# Altium schematic sheet IDC2BNC.SchDoc: IDC to BNC
size 420 x 297 mm; Author: G.K.; CompanyName: WUT; DrawnBy: G.K.; Organization: WUT ISE; Address1: Warsaw Univeristy of Technology; Address2: Nowowiejska 15/19; DocumentNumber: 3; Revision: -; SheetNumber: 3; SheetTotal: 7; EDA_Number: ARTIQ; Projet: ARTIQ/SINARA; ModifiedBy: -; CreateDate: XX/XX/XXXX; CheckedDate: -; Title2: adapter; DivGrp: ISE; Designer: G.K.; ModifiedDate: -; ProjectName: 32 CHANNEL 16bit DAC
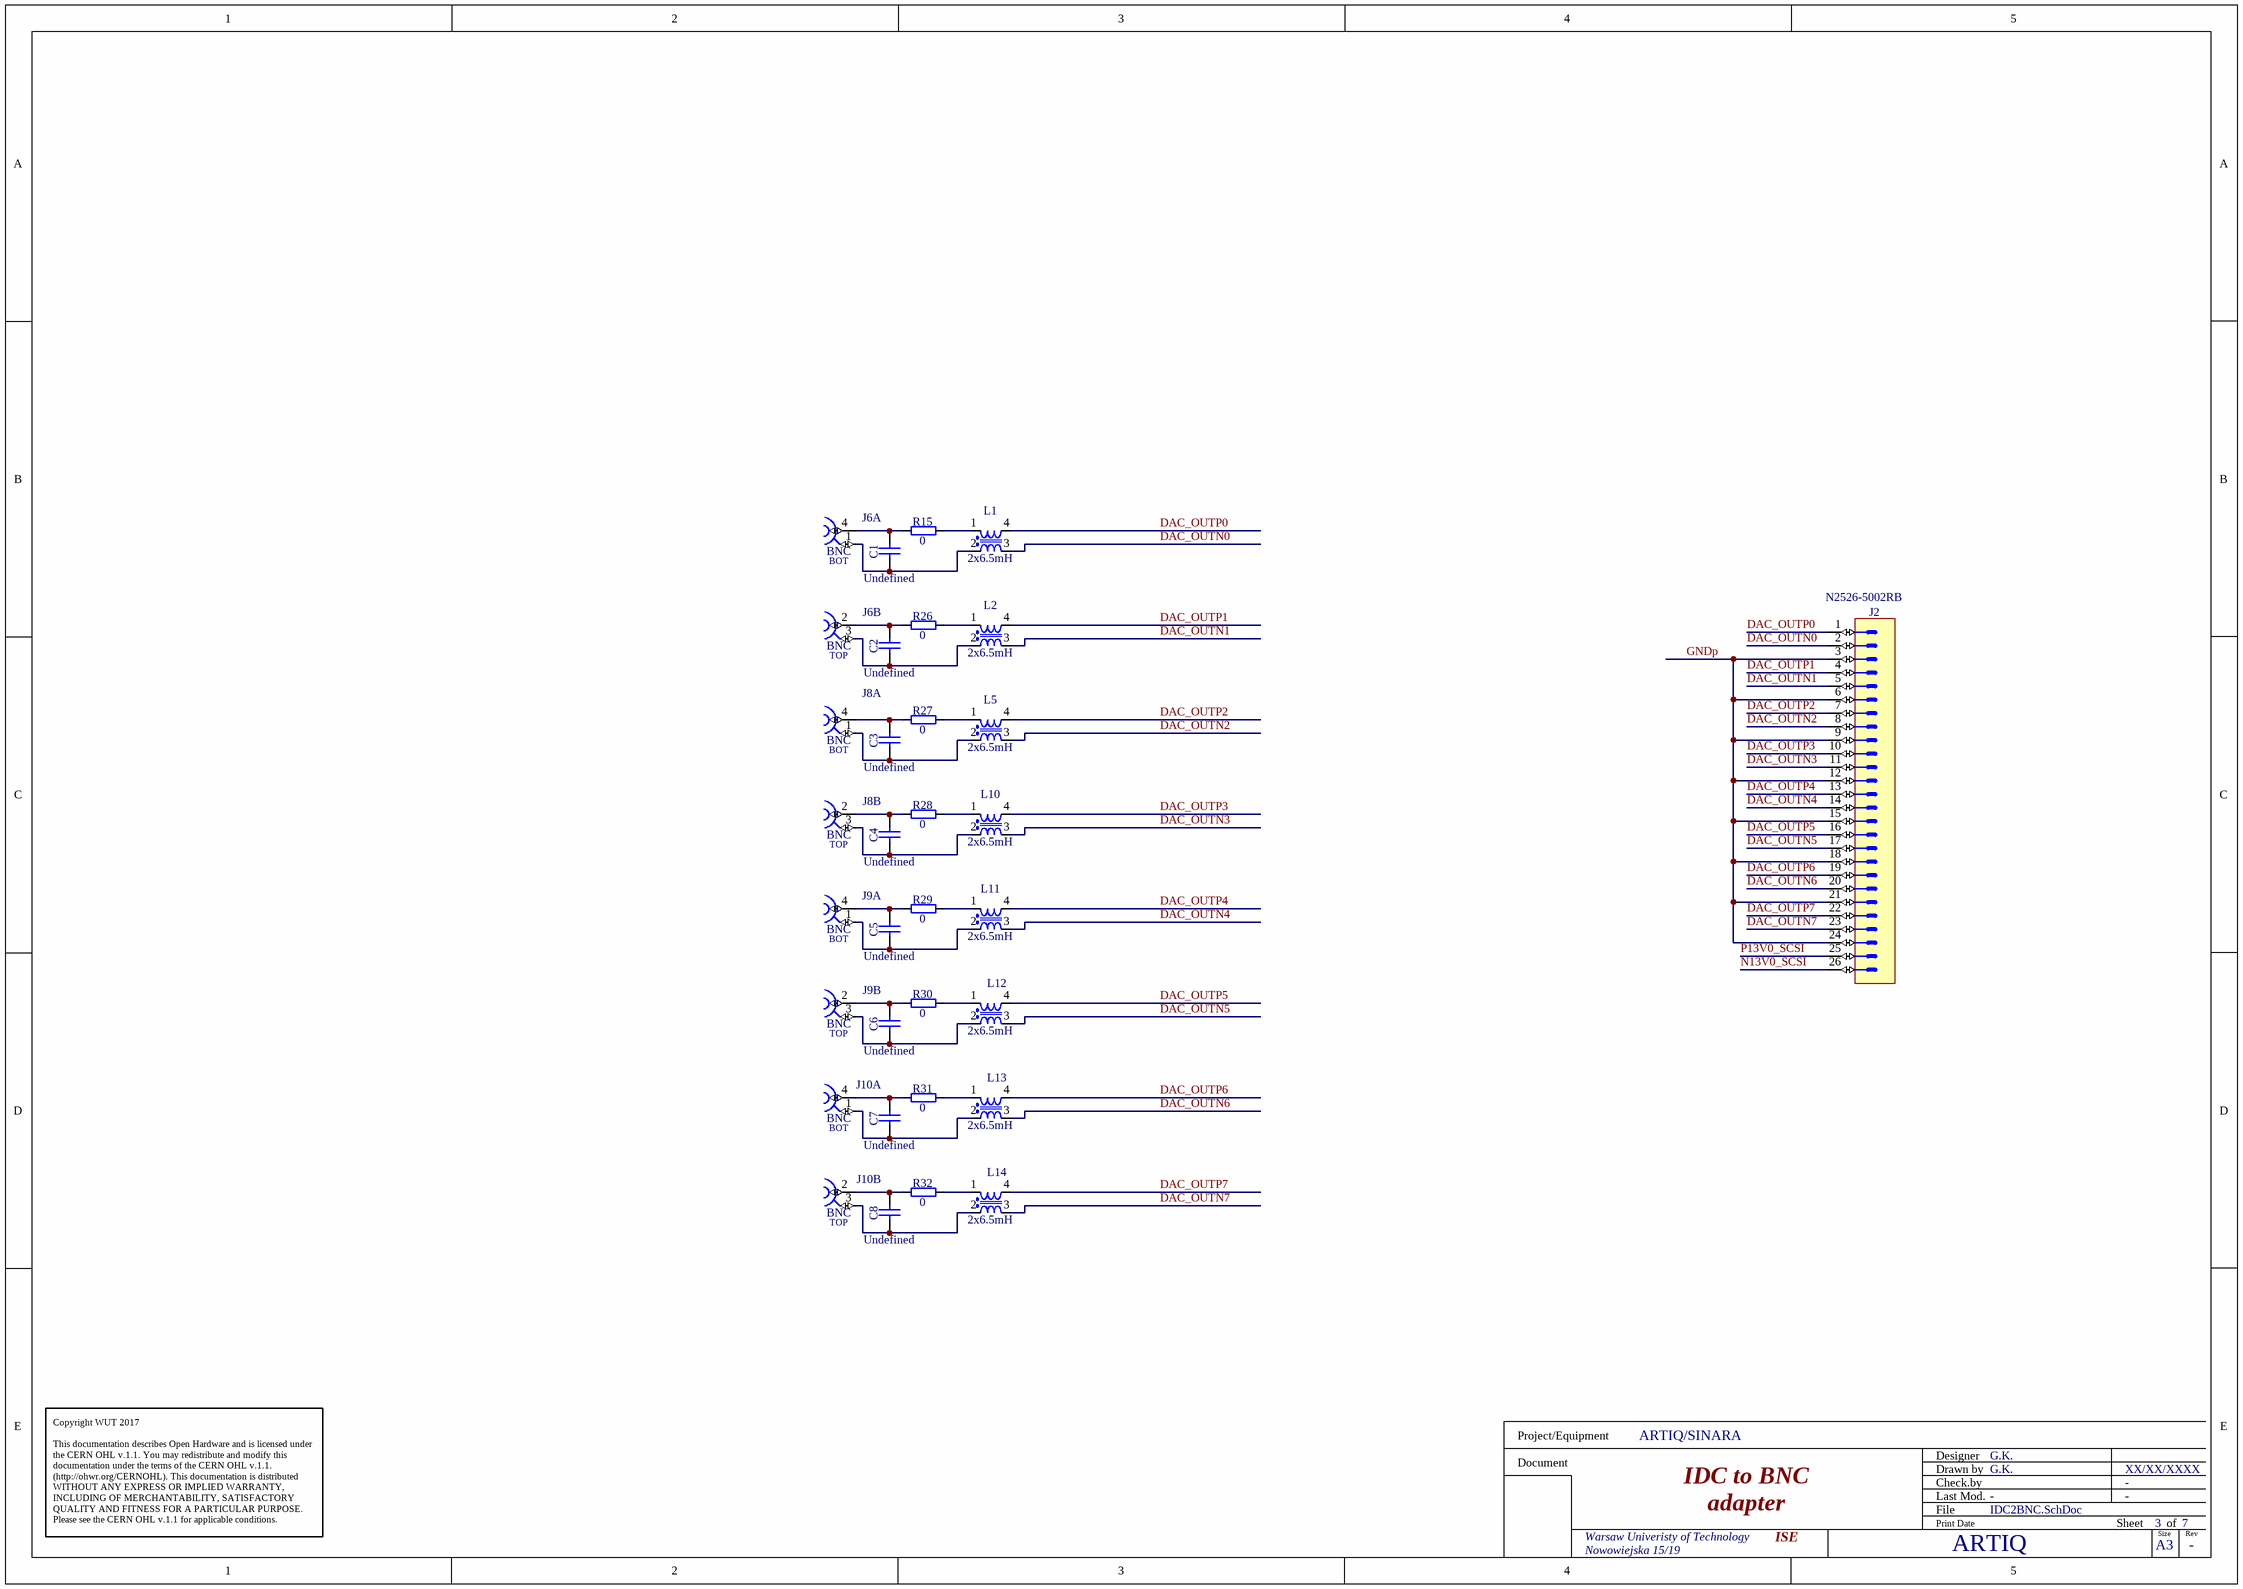
[diagram p0: IDC2BNC.SchDoc]

## Parts
C1  Undefined  [CAPC2012X135N]
C2  Undefined  [CAPC2012X135N]
C3  Undefined  [CAPC2012X135N]
C4  Undefined  [CAPC2012X135N]
C5  Undefined  [CAPC2012X135N]
C6  Undefined  [CAPC2012X135N]
C7  Undefined  [CAPC2012X135N]
C8  Undefined  [CAPC2012X135N]
J2  Manufacturer Part Number: N2526-5002RB  [3M_N2526-5002RB]  (hidden comment: Header 26)
J6  BNC  [BOMAR_364A2595]  (parts A,B of 2)
J8  BNC  [BOMAR_364A2595]  (parts A,B of 2)
J9  BNC  [BOMAR_364A2595]  (parts A,B of 2)
J10  BNC  [BOMAR_364A2595]  (parts A,B of 2)
L1  2x6.5mH  [IND_WURTH_WE-SL2]
L2  2x6.5mH  [IND_WURTH_WE-SL2]
L5  2x6.5mH  [IND_WURTH_WE-SL2]
L10  2x6.5mH  [IND_WURTH_WE-SL2]
L11  2x6.5mH  [IND_WURTH_WE-SL2]
L12  2x6.5mH  [IND_WURTH_WE-SL2]
L13  2x6.5mH  [IND_WURTH_WE-SL2]
L14  2x6.5mH  [IND_WURTH_WE-SL2]
R15  0  [RESC1608X55N]
R26  0  [RESC1608X55N]
R27  0  [RESC1608X55N]
R28  0  [RESC1608X55N]
R29  0  [RESC1608X55N]
R30  0  [RESC1608X55N]
R31  0  [RESC1608X55N]
R32  0  [RESC1608X55N]

## Nets
DAC_OUTN0: J2.2 L1.3
DAC_OUTN1: J2.5 L2.3
DAC_OUTN2: J2.8 L5.3
DAC_OUTN3: J2.11 L10.3
DAC_OUTN4: J2.14 L11.3
DAC_OUTN5: J2.17 L12.3
DAC_OUTN6: J2.20 L13.3
DAC_OUTN7: J2.23 L14.3
DAC_OUTP0: J2.1 L1.4
DAC_OUTP1: J2.4 L2.4
DAC_OUTP2: J2.7 L5.4
DAC_OUTP3: J2.10 L10.4
DAC_OUTP4: J2.13 L11.4
DAC_OUTP5: J2.16 L12.4
DAC_OUTP6: J2.19 L13.4
DAC_OUTP7: J2.22 L14.4
GNDp: J2.3 J2.6 J2.9 J2.12 J2.15 J2.18 J2.21 J2.24
N13V0_SCSI: J2.26
P13V0_SCSI: J2.25
NetC1_1: C1.1 J6.1 L1.2
NetC1_2: C1.2 J6.4 R15.1
NetC2_1: C2.1 J6.3 L2.2
NetC2_2: C2.2 J6.2 R26.1
NetC3_1: C3.1 J8.1 L5.2
NetC3_2: C3.2 J8.4 R27.1
NetC4_1: C4.1 J8.3 L10.2
NetC4_2: C4.2 J8.2 R28.1
NetC5_1: C5.1 J9.1 L11.2
NetC5_2: C5.2 J9.4 R29.1
NetC6_1: C6.1 J9.3 L12.2
NetC6_2: C6.2 J9.2 R30.1
NetC7_1: C7.1 J10.1 L13.2
NetC7_2: C7.2 J10.4 R31.1
NetC8_1: C8.1 J10.3 L14.2
NetC8_2: C8.2 J10.2 R32.1
NetL1_1: L1.1 R15.2
NetL2_1: L2.1 R26.2
NetL5_1: L5.1 R27.2
NetL10_1: L10.1 R28.2
NetL11_1: L11.1 R29.2
NetL12_1: L12.1 R30.2
NetL13_1: L13.1 R31.2
NetL14_1: L14.1 R32.2

## Notes on the sheet
- Copyright WUT 2017
  This documentation describes Open Hardware and is licensed under the CERN OHL v.1.1. You may redistribute and modify this documentation under the terms of the CERN OHL v.1.1. (http://ohwr.org/CERNOHL). This documentation is distributed WITHOUT ANY EXPRESS OR IMPLIED WARRANTY, INCLUDING OF MERCHANTABILITY, SATISFACTORY QUALITY AND FITNESS FOR A PARTICULAR PURPOSE. Please see the CERN OHL v.1.1 for applicable conditions.
- Project/Equipment
- Document
- Designer
- Drawn by
- Check.by
- File
- Last Mod.
- Print Date
- Sheet
- Size
- A3
- of
- Rev
- (in symbol BOMAR_364A2595, part A) BOT
- (in symbol BOMAR_364A2595, part B) TOP

## Library data of the parts
C1-C8 = CC0805_NO-VALUE: Non-polarised capacitor; Part Description: Reserved Footprint For 0805(2012) Chip Ceramic Capacitor; Mounted: No; Part Number: CC0805_NO-VALUE; Component Kind: Standard; Component Type: Standard; Pin Count: 2; Value: Undefined; Status: None; Manufacturer: Undefined; Manufacturer Part Number: CC0805_NO-VALUE; Case: 0805; Socket: No; SMD: Yes; Sense: No; Manufacturer1 ComponentHeight: 1.35mm; HelpURL: Undefined; Author: CERN DEM JLC; CreateDate: 10.12.2008; LatestRevisionDate: 11.09.2013
J2 = 3M_N2526-5002RB: Connector 26 Male; Part Description: 26 Contacts - Right Angle .100" x .100" Low Profile Four-Wall Header, 2500 Series; Manufacturer: 3M; PressFit: No; Part Number: 3M_N2526-5002RB; Component Kind: Standard; Component Type: Standard; Pin Count: 26; Family: Header 26; Mounted: Yes; Socket: No; SMD: No; Sense: No; Status: None; ComponentHeight: 8.59mm; HelpURL: \\cern.ch\dfs\Applications\Altium\Datasheets\3M_N2526-5002RB.pdf; Author: CERN DEM JLC; CreateDate: 29.10.2008; LatestRevisionDate: 11.08.2009
J6 J8-J10 = BOMAR_364A2595: Dual Right Angle 50 Ohm BNC Jack, White Valox Case; Manufacturer: BOMAR INTERCONNECT; PressFit: No; Part Number: BOMAR_364A2595; Component Kind: Standard; Component Type: Standard; Pin Count: 6; Family: BNC; Mounted: Yes; Socket: No; SMD: No; Sense: No; Status: None; Part Description: Dual Right Angle 50 Ohm BNC Jack, White Valox Case; Manufacturer Part Number: 364A2595; ComponentHeight: 29.3mm; HelpURL: \\cern.ch\dfs\Applications\Altium\Datasheets\BOMAR_364A2595.pdf; Author: CERN DEM JLC; CreateDate: 09.04.2013; LatestRevisionDate: 09.04.2013
L1 L2 L5 L10-L14 = IND_6.5MH_50%_WURTH_WE-SL2-744229: Inductor Common Mode; Part Description: Common Mode SMD Line Filter (WE-SL2 Serie); Manufacturer: WURTH ELEKTRONIK; Manufacturer Part Number: 744229; Power: 400mA; Resistance: 0.95R; Tolerance: ±50%; Part Number: IND_6.5MH_50%_WURTH_WE-SL2-744229; Component Kind: Standard; Component Type: Standard; Pin Count: 4; Value: 2x6.5mH; Status: None; Mounted: Yes; Socket: No; SMD: Yes; Sense: No; ComponentHeight: 5.3mm; HelpURL: \\cern.ch\dfs\Applications\Altium\Datasheets\IND_WURTH_WE-SL2_744229.pdf; Author: CERN DEM JLC; CreateDate: 01.10.2012; LatestRevisionDate: 15.10.2012
R15 R26-R32 = R0603_0R_JUMPER: Resistor; Part Description: 1A (0.05R Max DC Resistance) Zero Ohm Jumper; Manufacturer: GENERIC; Manufacturer1 Part Number: NRC06Z0; Part Number: R0603_0R_JUMPER; Component Kind: Standard; Component Type: Standard; Pin Count: 2; Value: 0; Status: Preferred; Manufacturer Part Number: R0603_0R_JUMPER; Case: 0603; Mounted: Yes; Sense: No; Socket: No; SMD: Yes; Manufacturer1 Example: NIC COMPONENT; Manufacturer1 ComponentHeight: 0.55mm; HelpURL: \\cern.ch\dfs\Applications\Altium\Datasheets\R0603_NIC_NRC.pdf; Author: CERN DEM JLC; CreateDate: 03.12.2007; LatestRevisionDate: 13.03.2008